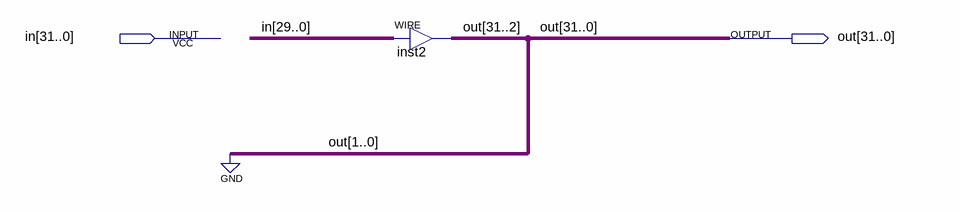
[diagram p0: schematic sheet]
// Quartus schematic ShiftLeft2.bdf as structural Verilog: 1 symbols, 2 pins
module ShiftLeft2 (
  input  [31:0] in,
  output [31:0] out
);

  assign out[31:2] = in[29:0];  // WIRE inst2

  assign out[1:0] = 2'b00;
endmodule
